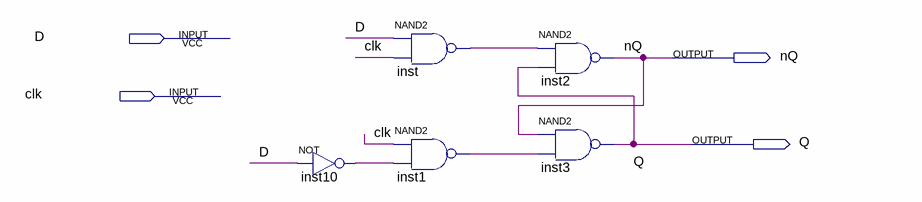
[diagram p0: schematic sheet]
// Quartus schematic latchD.bdf as structural Verilog: 5 symbols, 4 pins
module latchD (
  input  D,
  input  clk,
  output nQ,
  output Q
);

  wire inst1_out, inst10_out, inst_out;

  not inst10 (inst10_out, D);
  nand inst (inst_out, D, clk);
  nand inst1 (inst1_out, clk, inst10_out);
  nand inst2 (nQ, inst_out, Q);
  nand inst3 (Q, nQ, inst1_out);
endmodule
